# Altium schematic sheet mcu.SchDoc
size A4; SheetNumber: 3; SheetTotal: 4
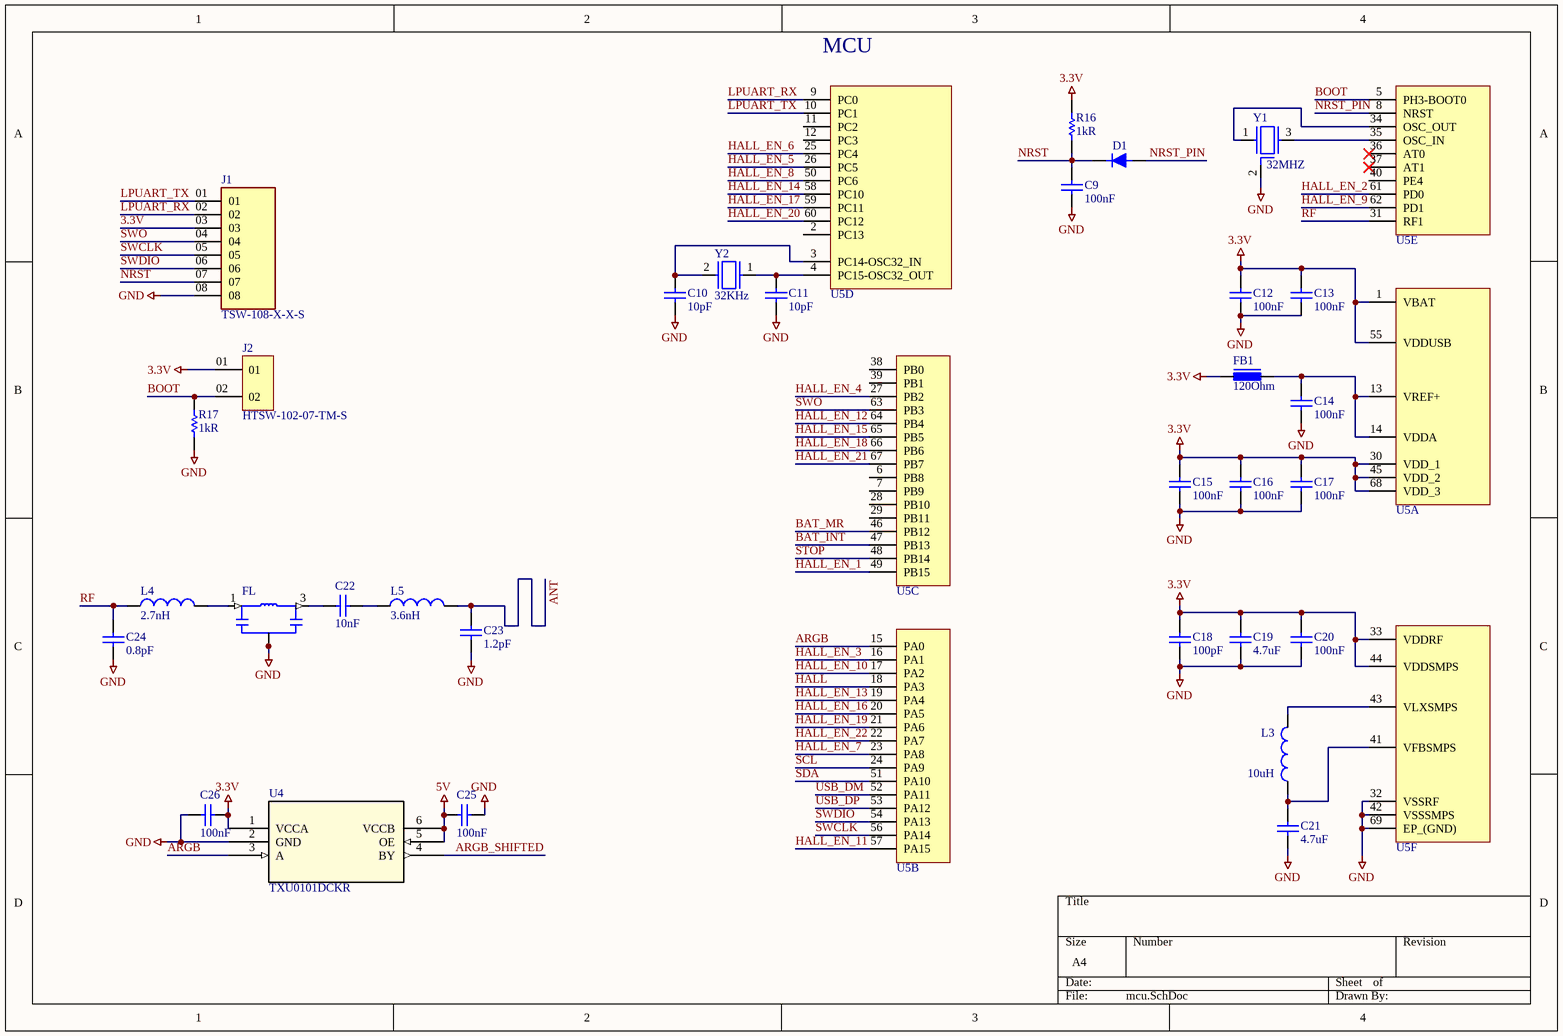
[diagram p0: mcu.SchDoc]

## Parts
C9  100nF  [CAP_0402]
C10  10pF  [CAP_0402]
C11  10pF  [CAP_0402]
C12  100nF  [CAP_0402]
C13  100nF  [CAP_0402]
C14  100nF  [CAP_0402]
C15  100nF  [CAP_0402]
C16  100nF  [CAP_0402]
C17  100nF  [CAP_0402]
C18  100pF  [CAP_0402]
C19  4.7uF  [CAP_0402]
C20  100nF  [CAP_0402]
C21  4.7uF  [CAP_0402]
C22  10nF  [CAP_0402]
C23  1.2pF  [CAP_0402]
C24  0.8pF  [CAP_0402]
C25  100nF  [CAP_0402]
C26  100nF  [CAP_0402]
D1  0.3A  [SODFL1608X70N]  (value not drawn)
FB1  120Ohm  [BEADC1005X50N]
FL  LFB182G45CGFD436  [FIL_LFB182G45CGFD436]  (value not drawn)
J1  TSW-108-X-X-S  [SAMTEC_TSW-108-X-X-S]
J2  HTSW-102-07-TM-S  [SAMTEC_HTSW-102-07-TM-S]
L3  10uH  [INDC1106X70N]
L4  2.7nH  [INDC1005X55N]
L5  3.6nH  [INDC1005X55N]
R16  1kR  [RES_0402]
R17  1kR  [RES_0402]
U4  TXU0101DCKR  [TXU0101DCKR]
U5  STM32WB55RGV6  [QFN40P800X800X100-69L-D]  (value not drawn)  (parts A,B,C,D,E,F of 6)
Y1  32MHZ  [NX2016SA32MEXS00ACS06465]
Y2  32KHz  [NX2012SA32768KSTDMUB1]

## Nets
3.3V: C12.2 C13.2 C15.2 C16.2 C17.2 C18.2 C19.2 C20.2 C26.1 FB1.1 J1.03 J2.01 R16.2 U4.1(VCCA) U5.1(VBAT) U5.30(VDD_1) U5.33(VDDRF) U5.44(VDDSMPS) U5.45(VDD_2) U5.55(VDDUSB) U5.68(VDD_3)
5V: C25.2 U4.5(OE) U4.6(VCCB)
GND: C9.2 C10.1 C11.1 C12.1 C13.1 C14.1 C15.1 C16.1 C17.1 C18.1 C19.1 C20.1 C21.1 C23.2 C24.1 C25.1 C26.2 FL.2(GND) FL.2_1(GND) J1.08 R17.1 U4.2(GND) U5.32(VSSRF) U5.42(VSSSMPS) U5.69(EP_(GND)) Y1.2(GND)
ANT: C23.1 L5.2
ARGB: U4.3(A) U5.15(PA0)
ARGB_SHIFTED: U4.4(BY)
BAT_INT: U5.47(PB13)
BAT_MR: U5.46(PB12)
BOOT: J2.02 R17.2 U5.5(PH3-BOOT0)
HALL: U5.18(PA3)
HALL_EN_1: U5.49(PB15)
HALL_EN_2: U5.61(PD0)
HALL_EN_3: U5.16(PA1)
HALL_EN_4: U5.27(PB2)
HALL_EN_5: U5.26(PC5)
HALL_EN_6: U5.25(PC4)
HALL_EN_7: U5.23(PA8)
HALL_EN_8: U5.50(PC6)
HALL_EN_9: U5.62(PD1)
HALL_EN_10: U5.17(PA2)
HALL_EN_11: U5.57(PA15)
HALL_EN_12: U5.64(PB4)
HALL_EN_13: U5.19(PA4)
HALL_EN_14: U5.58(PC10)
HALL_EN_15: U5.65(PB5)
HALL_EN_16: U5.20(PA5)
HALL_EN_17: U5.59(PC11)
HALL_EN_18: U5.66(PB6)
HALL_EN_19: U5.21(PA6)
HALL_EN_20: U5.60(PC12)
HALL_EN_21: U5.67(PB7)
HALL_EN_22: U5.22(PA7)
LPUART_RX: J1.02 U5.9(PC0)
LPUART_TX: J1.01 U5.10(PC1)
NRST: C9.1 D1.1(K) J1.07 R16.1
NRST_PIN: D1.2(A) U5.8(NRST)
RF: C24.2 L4.1 U5.31(RF1)
SCL: U5.24(PA9)
SDA: U5.51(PA10)
STOP: U5.48(PB14)
SWCLK: J1.05 U5.56(PA14)
SWDIO: J1.06 U5.54(PA13)
SWO: J1.04 U5.63(PB3)
USB_DM: U5.52(PA11)
USB_DP: U5.53(PA12)
NetC10_2: C10.2 U5.3(PC14-OSC32_IN) Y2.2(CRYSTAL_2)
NetC11_2: C11.2 U5.4(PC15-OSC32_OUT) Y2.1(CRYSTAL_1)
NetC14_2: C14.2 FB1.2 U5.13(VREF+) U5.14(VDDA)
NetC21_2: C21.2 L3.1 U5.41(VFBSMPS)
NetC22_1: C22.1 FL.3(OUT)
NetC22_2: C22.2 L5.1
NetFL_1: FL.1(IN) L4.2
NetL3_2: L3.2 U5.43(VLXSMPS)
NetU5_34: U5.34(OSC_OUT) Y1.1(CRYSTAL_1)
NetU5_35: U5.35(OSC_IN) Y1.3(CRYSTAL_2)

Not connected (* = marked no-connect by the designer): U5 2(PC13) 6(PB8) 7(PB9) 11(PC2) 12(PC3) 28(PB10) 29(PB11) 36(AT0)* 37(AT1)* 38(PB0) 39(PB1) 40(PE4)

## Notes on the sheet
- (near U5) MCU

## Library data of the parts
C9 C12-C17 C20 C25 C26 = Cap_100nF_0402: MF: Murata; MP: GRM022R60J222KE19L; BOM_GROUP: MCU & Payload; SnapEDA_Link: https://www.snapeda.com/parts/GRM022R60J222KE19L/Murata/view-part/?ref=snap; Package: 0402 Murata; Value: *; Check_prices: https://www.snapeda.com/parts/GRM022R60J222KE19L/Murata/view-part/?ref=eda
C10 C11 = Cap_10pF_0402: MF: Murata; MP: GRM022R60J222KE19L; BOM_GROUP: MCU & Payload; SnapEDA_Link: https://www.snapeda.com/parts/GRM022R60J222KE19L/Murata/view-part/?ref=snap; Package: 0402 Murata; Value: *; Check_prices: https://www.snapeda.com/parts/GRM022R60J222KE19L/Murata/view-part/?ref=eda
C18 = Cap_100pF_0402: MF: Murata; MP: GRM022R60J222KE19L; BOM_GROUP: MCU & Payload; SnapEDA_Link: https://www.snapeda.com/parts/GRM022R60J222KE19L/Murata/view-part/?ref=snap; Package: 0402 Murata; Value: *; Check_prices: https://www.snapeda.com/parts/GRM022R60J222KE19L/Murata/view-part/?ref=eda
C19 C21 = Cap_4.7uF_0402: MF: Murata; MP: GRM022R60J222KE19L; BOM_GROUP: MCU & Payload; SnapEDA_Link: https://www.snapeda.com/parts/GRM022R60J222KE19L/Murata/view-part/?ref=snap; Package: 0402 Murata; Value: *; Check_prices: https://www.snapeda.com/parts/GRM022R60J222KE19L/Murata/view-part/?ref=eda
C22 = Cap_10nF_0402: BOM_GROUP: Antena; MF: Murata; MP: GRM022R60J222KE19L; SnapEDA_Link: https://www.snapeda.com/parts/GRM022R60J222KE19L/Murata/view-part/?ref=snap; Package: 0402 Murata; Check_prices: https://www.snapeda.com/parts/GRM022R60J222KE19L/Murata/view-part/?ref=eda; Parameter 1: *
C23 = Cap_1.2pF_0402: BOM_GROUP: Antena; MF: Murata; MP: GRM022R60J222KE19L; SnapEDA_Link: https://www.snapeda.com/parts/GRM022R60J222KE19L/Murata/view-part/?ref=snap; Package: 0402 Murata; Check_prices: https://www.snapeda.com/parts/GRM022R60J222KE19L/Murata/view-part/?ref=eda; Parameter 1: *
C24 = Cap_0.8pF_0402: BOM_GROUP: Antena; MF: Murata; MP: GRM022R60J222KE19L; SnapEDA_Link: https://www.snapeda.com/parts/GRM022R60J222KE19L/Murata/view-part/?ref=snap; Package: 0402 Murata; Check_prices: https://www.snapeda.com/parts/GRM022R60J222KE19L/Murata/view-part/?ref=eda; Parameter 1: *
D1 = BAT54KFILM: BAT54KFILM, Schottky Diode,  0.3A max, 40V 5ns, 2-Pin, SOD-523; Manufacturer_Name: STMicroelectronics; Geometry.Height: 0.7mm; BOM_GROUP: MCU & Payload; Mouser Part Number: 511-BAT54KFILM; Mouser Price/Stock: https://www.mouser.co.uk/ProductDetail/STMicroelectronics/BAT54KFILM?qs=jZi1jxfVU95Y9ce6l3OT%252BA%3D%3D; Manufacturer_Part_Number: BAT54KFILM; Datasheet Link: http://www.st.com/web/en/resource/technical/document/datasheet/CD00001322.pdf
FB1 = MMZ1005S121CTD25: Ferrite Bead; MF: Tai Tech; MP: FCM1608KF-601T05; BOM_GROUP: MCU & Payload; SnapEDA_Link: https://www.snapeda.com/parts/FCM1608KF-601T05/Tai+Tech/view-part/?ref=snap; Package: None; Value: *; Check_prices: https://www.snapeda.com/parts/FCM1608KF-601T05/Tai+Tech/view-part/?ref=eda
FL = LFB182G45CGFD436: RF Filter Band Pass 2450MHz 2400MHz to 2500MHz 2.8dB 50Ohm SMD 6Pin 0603; BOM_GROUP: Antena; MF: Murata; Availability: Unavailable; Price: None; Package: 0603 Murata Electronics; MP: LFB182G45CGFD436; SnapEDA_Link: https://www.snapeda.com/parts/LFB182G45CGFD436/Murata/view-part/2721840/?ref=snap; Parameter 1: *
J1 = TSW-108-X-X-S: Connector Header Through Hole 8 position 0.100 (2.54mm); MF: Samtec; MP: TSW-108-23-L-S; BOM_GROUP: MCU & Payload; SnapEDA_Link: https://www.snapeda.com/parts/TSW-108-23-L-S/Samtec/view-part/?ref=snap; Package: None; Value: *; Check_prices: https://www.snapeda.com/parts/TSW-108-23-L-S/Samtec/view-part/?ref=eda
J2 = HTSW-102-07-TM-S: HEADER, 2 CONTACTS, 1 ROW, THROUGH HOLE, 2.54 MM; Connector Systems:Board-to-Board; Pitch Spacing:2.54mm; No. of Rows:1Rows; No. of Contacts:2Contacts; Contact Termination Type:Through Hole; Product Range:HTSW Series; Gender:Header RoHS Compliant: Yes; MP: HTSW10207TMS; MF: Samtec; BOM_GROUP: MCU & Payload; SnapEDA_Link: https://www.snapeda.com/parts/HTSW10207TMS/Samtec/view-part/?ref=snap; Value: *; Purchase-URL: https://pricing.snapeda.com/search/part/HTSW10207TMS/?ref=eda; Availability: In Stock; Check_prices: https://www.snapeda.com/parts/HTSW10207TMS/Samtec/view-part/?ref=eda; Package: None; Price: None
L3 = LQW15DN100M00D: Inductor with Inductance: 10uH Tol. +/-20%, Package: 0402 (1005); MF: Murata Electronics North America; BOM_GROUP: MCU & Payload; Package: 1106 Murata; MP: LQW15DN100M00D; Purchase-URL: https://pricing.snapeda.com/search/part/LQW15DN100M00D/?ref=eda; Value: *; SnapEDA_Link: https://www.snapeda.com/parts/LQW15DN100M00D/Murata%20Electronics%20North%20America/view-part/3223358/?ref=snap; Availability: Good; Price: None; Check_prices: https://www.snapeda.com/parts/LQW15DN100M00D/Murata%20Electronics%20North%20America/view-part/3223358/?ref=eda
L4 L5 = LQG15HS3N6S02D: Inductor with Inductance: 3.6nH Tol. +/-0.3nH, Package: 0402 _1005_; MF: Murata; BOM_GROUP: Antena; Package: 1005 Murata; MP: LQG15HS3N6S02D; Price: None; Availability: Unavailable; SnapEDA_Link: https://www.snapeda.com/parts/LQG15HS3N6S02D/Murata%20Electronics%20North%20America/view-part/1501786/?ref=snap; Parameter 1: *
R16 R17 = Res_1kR_0402: BOM_GROUP: MCU & Payload; Package: 0402; Resistans: 1kR
U5 = STM32WB55RGV6: BOM_GROUP: MCU & Payload
Y1 = NX2016SA-32MHZ: Crystal or Oscillator; Manufacturer_Name: NDK; Manufacturer_Part_Number: NX2016SA-26MHZ-EXS00A-CS06025; BOM_GROUP: MCU & Payload; Datasheet Link: https://datasheet.datasheetarchive.com/originals/distributors/Datasheets_SAMA/8da4d094c01ffba0c34ffc4b8a2d69e9.pdf; Mouser Part Number: 344-NX2016SA26S06025; Mouser Price/Stock: https://www.mouser.co.uk/ProductDetail/NDK/NX2016SA-26MHZ-EXS00A-CS06025?qs=w%2Fv1CP2dgqrdkfe8%2Fku9TQ%3D%3D
Y2 = NX2012SA-32.768K: Crystal or Oscillator; Manufacturer_Name: NDK; Manufacturer_Part_Number: NX2012SA-32.768K-STD-MUB-1; BOM_GROUP: MCU & Payload; Datasheet Link: https://www.mouser.de/datasheet/2/905/c_NX2012SA-STD-MUB-1_e-1317508.pdf; Height: 0.6mm; Mouser Part Number: 344-NX2012SA32768K1; Mouser Price/Stock: https://www.mouser.co.uk/ProductDetail/NDK/NX2012SA-32.768K-STD-MUB-1?qs=55YtniHzbhA%252B6%2Fl1MwFZaQ%3D%3D